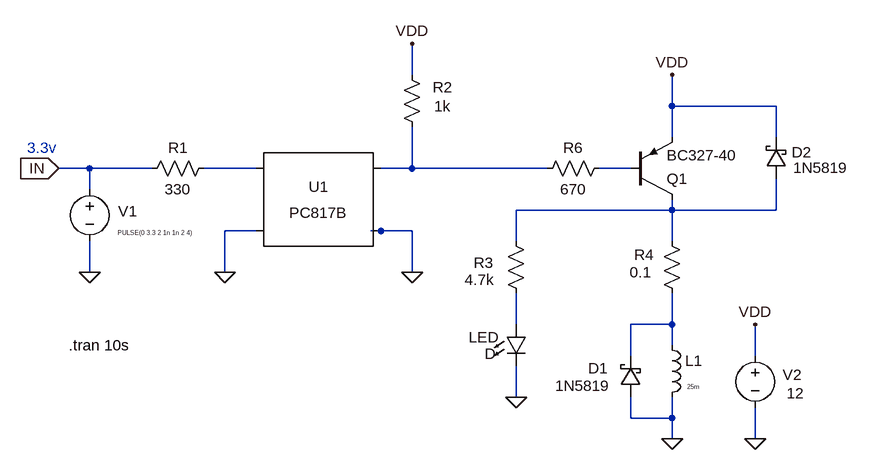
[diagram p0: schematic v2.0.asc]
v2.0.asc, the LTspice schematic file:
Version 4.1
SHEET 1 1660 680
WIRE 368 -16 368 -64
WIRE 768 32 768 -16
WIRE 928 32 768 32
WIRE 768 80 768 32
WIRE 928 80 928 32
WIRE -128 128 -176 128
WIRE -32 128 -128 128
WIRE 128 128 48 128
WIRE 368 128 368 64
WIRE 368 128 320 128
WIRE 576 128 368 128
WIRE 704 128 656 128
WIRE -128 160 -128 128
WIRE 768 192 768 176
WIRE 768 192 528 192
WIRE 928 192 928 144
WIRE 928 192 768 192
WIRE 128 224 80 224
WIRE 320 224 304 224
WIRE 368 224 320 224
WIRE 528 240 528 192
WIRE 768 240 768 192
WIRE -128 288 -128 240
WIRE 80 288 80 224
WIRE 368 288 368 224
WIRE 528 368 528 320
WIRE 768 368 768 320
WIRE 768 368 704 368
WIRE 768 400 768 368
WIRE 704 416 704 368
WIRE 896 416 896 368
WIRE 528 480 528 432
WIRE 704 512 704 480
WIRE 768 512 768 480
WIRE 768 512 704 512
WIRE 768 544 768 512
WIRE 896 544 896 496
FLAG 80 288 0
FLAG -128 288 0
FLAG 896 544 0
FLAG -176 128 IN
IOPIN -176 128 In
FLAG 896 368 VDD
FLAG 368 -64 VDD
FLAG 368 288 0
FLAG 768 -16 VDD
FLAG 768 544 0
FLAG 528 480 0
SYMBOL Optos\\PC817B 224 176 R0
SYMATTR InstName U1
SYMBOL res 352 -32 R0
WINDOW 0 48 35 Left 2
WINDOW 3 50 64 Left 2
SYMATTR InstName R2
SYMATTR Value 1k
SYMBOL voltage -128 144 R0
WINDOW 123 0 0 Left 0
WINDOW 39 0 0 Left 0
WINDOW 0 44 50 Left 2
WINDOW 3 43 83 Left 0
SYMATTR InstName V1
SYMATTR Value PULSE(0 3.3 2 1n 1n 2 4)
SYMBOL res 64 112 R90
WINDOW 0 0 56 VBottom 2
WINDOW 3 32 56 VTop 2
SYMATTR InstName R1
SYMATTR Value 330
SYMBOL voltage 896 400 R0
WINDOW 123 0 0 Left 0
WINDOW 39 0 0 Left 0
WINDOW 0 42 45 Left 2
WINDOW 3 48 74 Left 2
SYMATTR InstName V2
SYMATTR Value 12
SYMBOL ind 752 384 R0
WINDOW 3 39 80 Left 0
SYMATTR Value 25m
SYMATTR InstName L1
SYMATTR SpiceLine Rser=120
SYMBOL res 752 224 R0
WINDOW 0 -42 37 Left 2
WINDOW 3 -49 64 Left 2
SYMATTR InstName R4
SYMATTR Value 0.1
SYMBOL LED 512 368 R0
WINDOW 0 -57 20 Left 2
WINDOW 3 -32 45 Left 2
SYMATTR InstName LED
SYMBOL res 512 224 R0
WINDOW 0 -49 49 Left 2
WINDOW 3 -63 75 Left 2
SYMATTR InstName R3
SYMATTR Value 4.7k
SYMBOL schottky 720 480 R180
WINDOW 0 50 45 Left 2
WINDOW 3 47 18 Left 2
SYMATTR InstName D1
SYMATTR Value 1N5819
SYMBOL pnp 704 176 M180
SYMATTR InstName Q1
SYMATTR Value BC327-40
SYMBOL res 672 112 R90
WINDOW 0 0 56 VBottom 2
WINDOW 3 32 56 VTop 2
SYMATTR InstName R6
SYMATTR Value 670
SYMBOL schottky 944 144 R180
WINDOW 0 -39 41 Left 2
WINDOW 3 -95 17 Left 2
SYMATTR InstName D2
SYMATTR Value 1N5819
TEXT -160 400 Left 2 !.tran 10s
TEXT -224 96 Left 2 ;3.3v

The netlist it stands for:
* v2.0.asc
X§U1 N001 0 N002 0 PC817 Igain=1.5m
R2 VDD N002 1k
V1 IN 0 PULSE(0 3.3 2 1n 1n 2 4)
R1 N001 IN 330
V2 VDD 0 12
L1 N006 0 25m Rser=120
R4 N004 N006 0.1
D§LED N005 0 D
R3 N004 N005 4.7k
D1 0 N006 1N5819
Q1 N004 N003 VDD 0 BC327-40
R6 N003 N002 670
D2 N004 VDD 1N5819
.model D D
.lib standard.dio
.model NPN NPN
.model PNP PNP
.lib standard.bjt
.tran 10s
* 3.3v
.lib PC817.sub
.backanno
.end